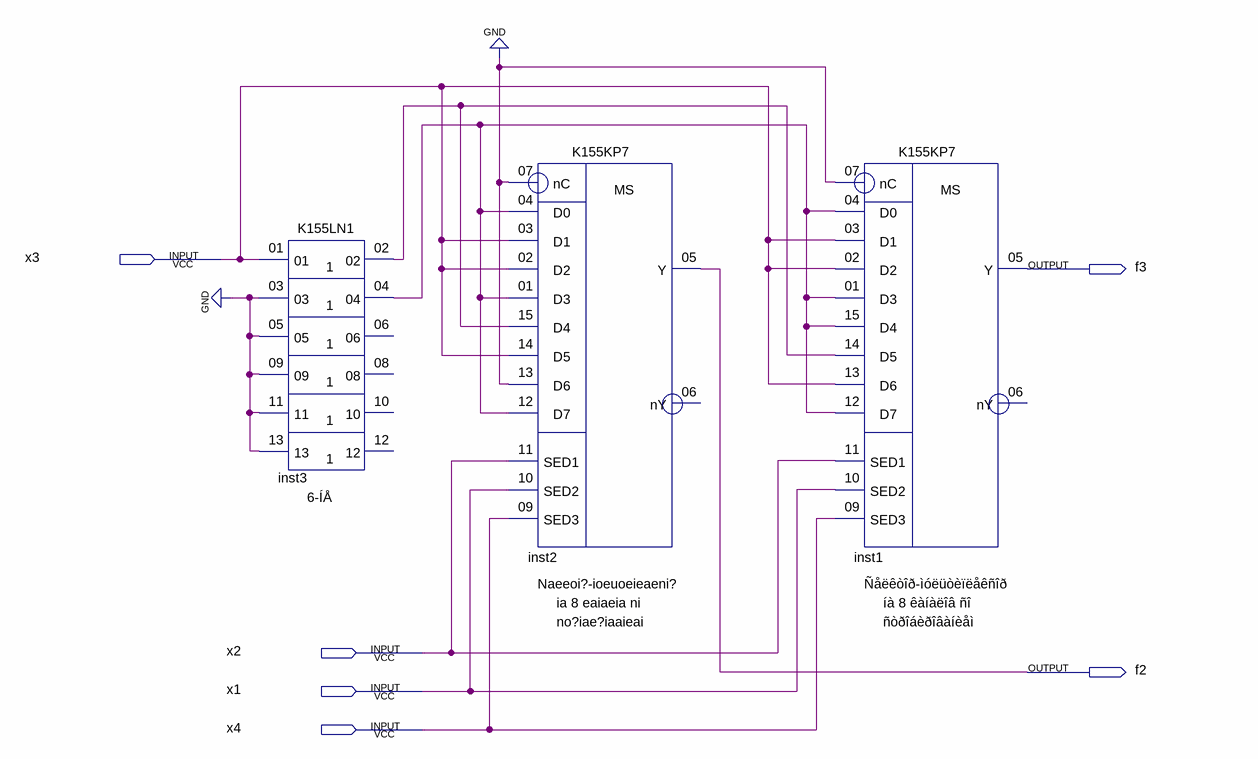
[diagram p0: schematic sheet]
// Quartus schematic three_addr.bdf as structural Verilog: 3 symbols, 6 pins
module three_addr (
  input  x3,
  input  x2,
  input  x1,
  input  x4,
  output f3,
  output f2
);

  wire inst3_02, inst3_04;

  K155LN1 inst3 (
    .\01 (x3), .\03 (1'b0), .\05 (1'b0), .\09 (1'b0), .\11 (1'b0), .\13 (1'b0), .\02 (inst3_02),
    .\04 (inst3_04));  // open: 06, 08, 10, 12
  K155KP7 inst2 (
    .nC(1'b0), .D0(inst3_04), .D1(x3), .D2(x3), .D3(inst3_04), .D4(inst3_02), .D5(x3), .D6(1'b0),
    .D7(inst3_04), .SED1(x2), .SED2(x1), .SED3(x4), .Y(f2));  // open: nY
  K155KP7 inst1 (
    .nC(1'b0), .D0(inst3_04), .D1(x3), .D2(x3), .D3(inst3_04), .D4(inst3_04), .D5(inst3_02), .D6(x3),
    .D7(inst3_04), .SED1(x2), .SED2(x1), .SED3(x4), .Y(f3));  // open: nY
endmodule
